# Altium schematic sheet 1_键盘矩阵.schdoc.schdoc
size 515 x 386 mm; Name: A_Customize; Symbol: A_Customize; Device: A_Customize; @Project Name: keyboard_Tassel43; REV: 1.0; Date: 2022-05-21; Sheet: 1/1; Draw By: Sanksu; Company: Your Company; Convert to PCB: yes; Add into BOM: yes
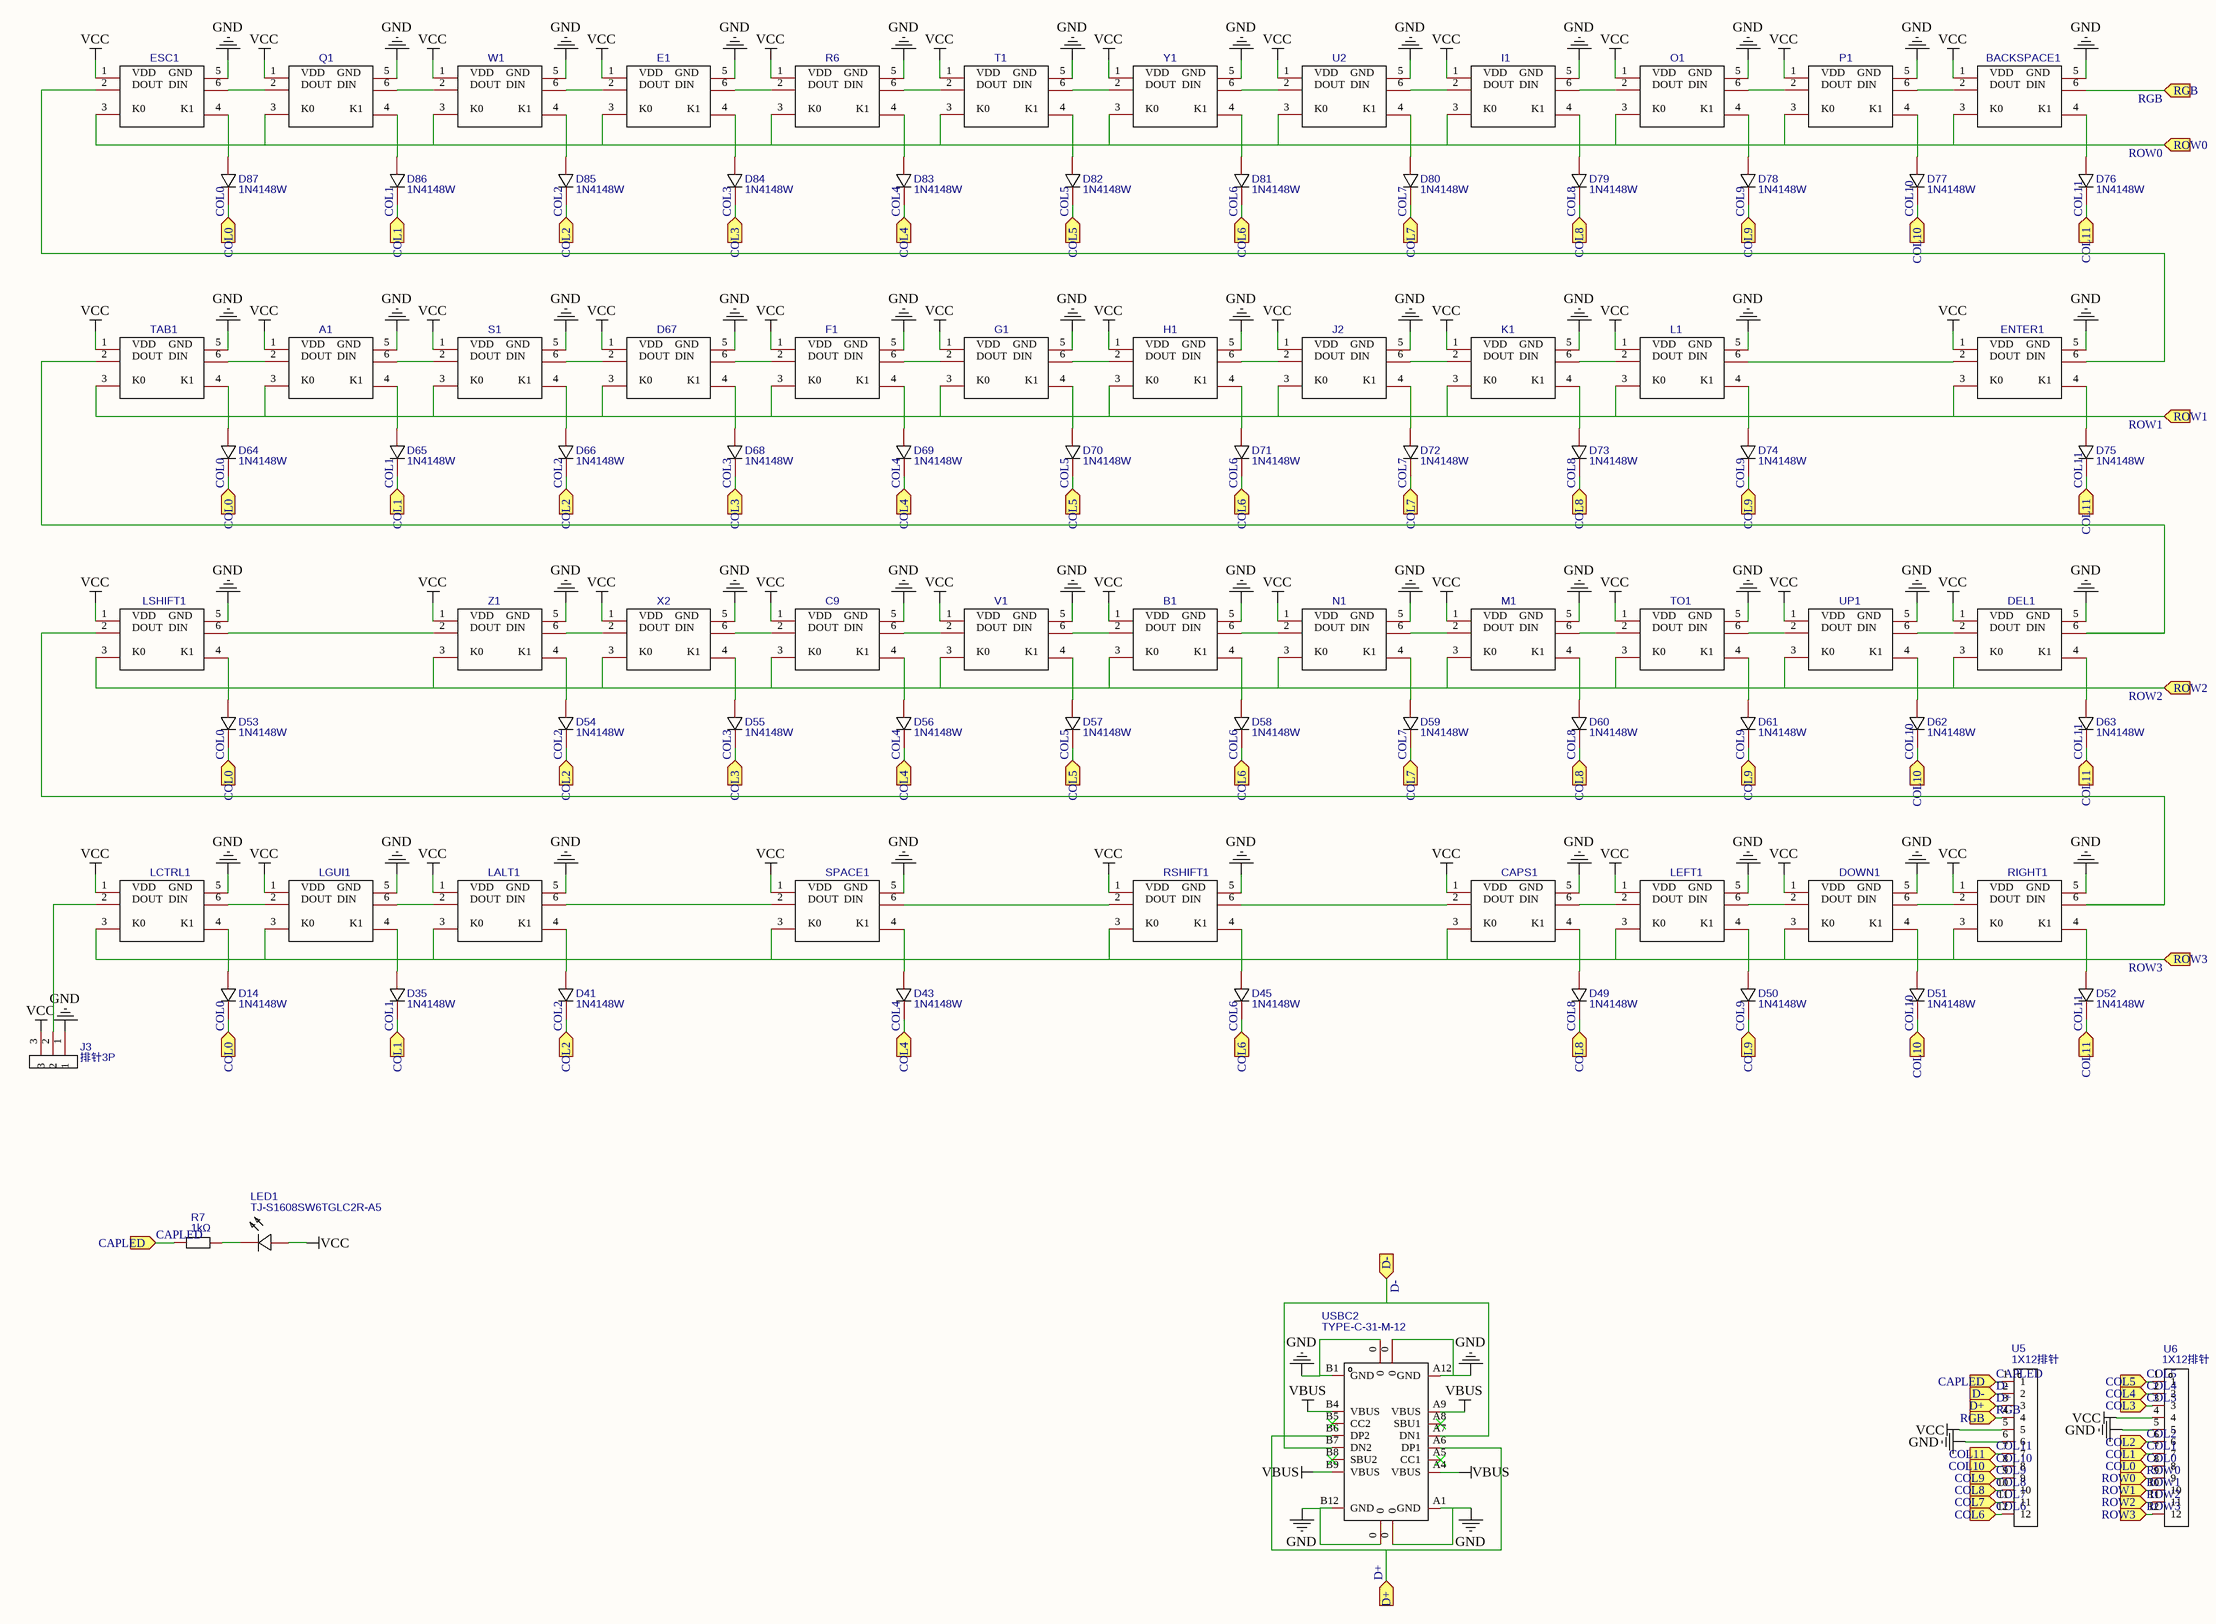
[diagram p0: 1_键盘矩阵.schdoc.schdoc]

## Parts
A1  凯华轴座+3528反贴灯  [凯华轴座+3528反贴灯]  (value not drawn)
B1  凯华轴座+3528反贴灯  [凯华轴座+3528反贴灯]  (value not drawn)
BACKSPACE1  凯华轴座+3528反贴灯  [凯华轴座+3528反贴灯]  (value not drawn)
C9  凯华轴座+3528反贴灯  [凯华轴座+3528反贴灯]  (value not drawn)
CAPS1  凯华轴座+3528反贴灯  [凯华轴座+3528反贴灯]  (value not drawn)
D14  1N4148W  [SOD-123_L2.8-W1.8-LS3.7-RD]
D35  1N4148W  [SOD-123_L2.8-W1.8-LS3.7-RD]
D41  1N4148W  [SOD-123_L2.8-W1.8-LS3.7-RD]
D43  1N4148W  [SOD-123_L2.8-W1.8-LS3.7-RD]
D45  1N4148W  [SOD-123_L2.8-W1.8-LS3.7-RD]
D49  1N4148W  [SOD-123_L2.8-W1.8-LS3.7-RD]
D50  1N4148W  [SOD-123_L2.8-W1.8-LS3.7-RD]
D51  1N4148W  [SOD-123_L2.8-W1.8-LS3.7-RD]
D52  1N4148W  [SOD-123_L2.8-W1.8-LS3.7-RD]
D53  1N4148W  [SOD-123_L2.8-W1.8-LS3.7-RD]
D54  1N4148W  [SOD-123_L2.8-W1.8-LS3.7-RD]
D55  1N4148W  [SOD-123_L2.8-W1.8-LS3.7-RD]
D56  1N4148W  [SOD-123_L2.8-W1.8-LS3.7-RD]
D57  1N4148W  [SOD-123_L2.8-W1.8-LS3.7-RD]
D58  1N4148W  [SOD-123_L2.8-W1.8-LS3.7-RD]
D59  1N4148W  [SOD-123_L2.8-W1.8-LS3.7-RD]
D60  1N4148W  [SOD-123_L2.8-W1.8-LS3.7-RD]
D61  1N4148W  [SOD-123_L2.8-W1.8-LS3.7-RD]
D62  1N4148W  [SOD-123_L2.8-W1.8-LS3.7-RD]
D63  1N4148W  [SOD-123_L2.8-W1.8-LS3.7-RD]
D64  1N4148W  [SOD-123_L2.8-W1.8-LS3.7-RD]
D65  1N4148W  [SOD-123_L2.8-W1.8-LS3.7-RD]
D66  1N4148W  [SOD-123_L2.8-W1.8-LS3.7-RD]
D67  凯华轴座+3528反贴灯  [凯华轴座+3528反贴灯]  (value not drawn)
D68  1N4148W  [SOD-123_L2.8-W1.8-LS3.7-RD]
D69  1N4148W  [SOD-123_L2.8-W1.8-LS3.7-RD]
D70  1N4148W  [SOD-123_L2.8-W1.8-LS3.7-RD]
D71  1N4148W  [SOD-123_L2.8-W1.8-LS3.7-RD]
D72  1N4148W  [SOD-123_L2.8-W1.8-LS3.7-RD]
D73  1N4148W  [SOD-123_L2.8-W1.8-LS3.7-RD]
D74  1N4148W  [SOD-123_L2.8-W1.8-LS3.7-RD]
D75  1N4148W  [SOD-123_L2.8-W1.8-LS3.7-RD]
D76  1N4148W  [SOD-123_L2.8-W1.8-LS3.7-RD]
D77  1N4148W  [SOD-123_L2.8-W1.8-LS3.7-RD]
D78  1N4148W  [SOD-123_L2.8-W1.8-LS3.7-RD]
D79  1N4148W  [SOD-123_L2.8-W1.8-LS3.7-RD]
D80  1N4148W  [SOD-123_L2.8-W1.8-LS3.7-RD]
D81  1N4148W  [SOD-123_L2.8-W1.8-LS3.7-RD]
D82  1N4148W  [SOD-123_L2.8-W1.8-LS3.7-RD]
D83  1N4148W  [SOD-123_L2.8-W1.8-LS3.7-RD]
D84  1N4148W  [SOD-123_L2.8-W1.8-LS3.7-RD]
D85  1N4148W  [SOD-123_L2.8-W1.8-LS3.7-RD]
D86  1N4148W  [SOD-123_L2.8-W1.8-LS3.7-RD]
D87  1N4148W  [SOD-123_L2.8-W1.8-LS3.7-RD]
DEL1  凯华轴座+3528反贴灯  [凯华轴座+3528反贴灯]  (value not drawn)
DOWN1  凯华轴座+3528反贴灯  [凯华轴座+3528反贴灯]  (value not drawn)
E1  凯华轴座+3528反贴灯  [凯华轴座+3528反贴灯]  (value not drawn)
ENTER1  凯华轴座+3528反贴灯  [凯华轴座+3528反贴灯]  (value not drawn)
ESC1  凯华轴座+3528反贴灯  [凯华轴座+3528反贴灯]  (value not drawn)
F1  凯华轴座+3528反贴灯  [凯华轴座+3528反贴灯]  (value not drawn)
G1  凯华轴座+3528反贴灯  [凯华轴座+3528反贴灯]  (value not drawn)
H1  凯华轴座+3528反贴灯  [凯华轴座+3528反贴灯]  (value not drawn)
I1  凯华轴座+3528反贴灯  [凯华轴座+3528反贴灯]  (value not drawn)
J2  凯华轴座+3528反贴灯  [凯华轴座+3528反贴灯]  (value not drawn)
J3  排针3P  [排针3P]
K1  凯华轴座+3528反贴灯  [凯华轴座+3528反贴灯]  (value not drawn)
L1  凯华轴座+3528反贴灯  [凯华轴座+3528反贴灯]  (value not drawn)
LALT1  凯华轴座+3528反贴灯  [凯华轴座+3528反贴灯]  (value not drawn)
LCTRL1  凯华轴座+3528反贴灯  [凯华轴座+3528反贴灯]  (value not drawn)
LED1  TJ-S1608SW6TGLC2R-A5  [LED0603-R-RD_RED]
LEFT1  凯华轴座+3528反贴灯  [凯华轴座+3528反贴灯]  (value not drawn)
LGUI1  凯华轴座+3528反贴灯  [凯华轴座+3528反贴灯]  (value not drawn)
LSHIFT1  凯华轴座+3528反贴灯  [凯华轴座+3528反贴灯]  (value not drawn)
M1  凯华轴座+3528反贴灯  [凯华轴座+3528反贴灯]  (value not drawn)
N1  凯华轴座+3528反贴灯  [凯华轴座+3528反贴灯]  (value not drawn)
O1  凯华轴座+3528反贴灯  [凯华轴座+3528反贴灯]  (value not drawn)
P1  凯华轴座+3528反贴灯  [凯华轴座+3528反贴灯]  (value not drawn)
Q1  凯华轴座+3528反贴灯  [凯华轴座+3528反贴灯]  (value not drawn)
R6  凯华轴座+3528反贴灯  [凯华轴座+3528反贴灯]  (value not drawn)
R7  1kΩ  [R0603]
RIGHT1  凯华轴座+3528反贴灯  [凯华轴座+3528反贴灯]  (value not drawn)
RSHIFT1  凯华轴座+3528反贴灯  [凯华轴座+3528反贴灯]  (value not drawn)
S1  凯华轴座+3528反贴灯  [凯华轴座+3528反贴灯]  (value not drawn)
SPACE1  凯华轴座+3528反贴灯  [凯华轴座+3528反贴灯]  (value not drawn)
T1  凯华轴座+3528反贴灯  [凯华轴座+3528反贴灯]  (value not drawn)
TAB1  凯华轴座+3528反贴灯  [凯华轴座+3528反贴灯]  (value not drawn)
TO1  凯华轴座+3528反贴灯  [凯华轴座+3528反贴灯]  (value not drawn)
U2  凯华轴座+3528反贴灯  [凯华轴座+3528反贴灯]  (value not drawn)
U5  1X12排针  [1X12排针]
U6  1X12排针  [1X12排针]
UP1  凯华轴座+3528反贴灯  [凯华轴座+3528反贴灯]  (value not drawn)
USBC2  TYPE-C-31-M-12  [USB-C_SMD-TYPE-C-31-M-12]
V1  凯华轴座+3528反贴灯  [凯华轴座+3528反贴灯]  (value not drawn)
W1  凯华轴座+3528反贴灯  [凯华轴座+3528反贴灯]  (value not drawn)
X2  凯华轴座+3528反贴灯  [凯华轴座+3528反贴灯]  (value not drawn)
Y1  凯华轴座+3528反贴灯  [凯华轴座+3528反贴灯]  (value not drawn)
Z1  凯华轴座+3528反贴灯  [凯华轴座+3528反贴灯]  (value not drawn)

## Ports
CAPLED (in), COL0 (in), COL1 (in), COL2 (in), COL3 (in), COL4 (in), COL5 (in), COL6 (in), COL7 (in), COL8 (in), COL9 (in), COL10 (in), COL11 (in), D+ (in), D- (in), RGB (in), ROW0 (in), ROW1 (in), ROW2 (in), ROW3 (in)

## Nets
GND: A1.5 B1.5 BACKSPACE1.5 C9.5 CAPS1.5 D67.5 DEL1.5 DOWN1.5 E1.5 ENTER1.5 ESC1.5 F1.5 G1.5 H1.5 I1.5 J2.5 J3.1 K1.5 L1.5 LALT1.5 LCTRL1.5 LEFT1.5 LGUI1.5 LSHIFT1.5 M1.5 N1.5 O1.5 P1.5 Q1.5 R6.5 RIGHT1.5 RSHIFT1.5 S1.5 SPACE1.5 T1.5 TAB1.5 TO1.5 U2.5 U5.6 U6.5 UP1.5 USBC2.0 USBC2.A1(GND) USBC2.A12(GND) USBC2.B1(GND) USBC2.B12(GND) V1.5 W1.5 X2.5 Y1.5 Z1.5
VBUS: USBC2.A4(VBUS) USBC2.A9(VBUS) USBC2.B4(VBUS) USBC2.B9(VBUS)
VCC: A1.1 B1.1 BACKSPACE1.1 C9.1 CAPS1.1 D67.1 DEL1.1 DOWN1.1 E1.1 ENTER1.1 ESC1.1 F1.1 G1.1 H1.1 I1.1 J2.1 J3.3 K1.1 L1.1 LALT1.1 LCTRL1.1 LED1.1(A) LEFT1.1 LGUI1.1 LSHIFT1.1 M1.1 N1.1 O1.1 P1.1 Q1.1 R6.1 RIGHT1.1 RSHIFT1.1 S1.1 SPACE1.1 T1.1 TAB1.1 TO1.1 U2.1 U5.5 U6.4 UP1.1 V1.1 W1.1 X2.1 Y1.1 Z1.1
CAPLED: R7.1 U5.1 ; port CAPLED
COL0: D14.1(K) D53.1(K) D64.1(K) D87.1(K) U6.8 ; port COL0
COL1: D35.1(K) D65.1(K) D86.1(K) U6.7 ; port COL1
COL2: D41.1(K) D54.1(K) D66.1(K) D85.1(K) U6.6 ; port COL2
COL3: D55.1(K) D68.1(K) D84.1(K) U6.3 ; port COL3
COL4: D43.1(K) D56.1(K) D69.1(K) D83.1(K) U6.2 ; port COL4
COL5: D57.1(K) D70.1(K) D82.1(K) U6.1 ; port COL5
COL6: D45.1(K) D58.1(K) D71.1(K) D81.1(K) U5.12 ; port COL6
COL7: D59.1(K) D72.1(K) D80.1(K) U5.11 ; port COL7
COL8: D49.1(K) D60.1(K) D73.1(K) D79.1(K) U5.10 ; port COL8
COL9: D50.1(K) D61.1(K) D74.1(K) D78.1(K) U5.9 ; port COL9
COL10: D51.1(K) D62.1(K) D77.1(K) U5.8 ; port COL10
COL11: D52.1(K) D63.1(K) D75.1(K) D76.1(K) U5.7 ; port COL11
D+: U5.3 USBC2.A6(DP1) USBC2.B6(DP2) ; port D+
D-: U5.2 USBC2.A7(DN1) USBC2.B7(DN2) ; port D-
RGB: BACKSPACE1.6 U5.4 ; port RGB
ROW0: BACKSPACE1.3 E1.3 ESC1.3 I1.3 O1.3 P1.3 Q1.3 R6.3 T1.3 U2.3 U6.9 W1.3 Y1.3 ; port ROW0
ROW1: A1.3 D67.3 ENTER1.3 F1.3 G1.3 H1.3 J2.3 K1.3 L1.3 S1.3 TAB1.3 U6.10 ; port ROW1
ROW2: B1.3 C9.3 DEL1.3 LSHIFT1.3 M1.3 N1.3 TO1.3 U6.11 UP1.3 V1.3 X2.3 Z1.3 ; port ROW2
ROW3: CAPS1.3 DOWN1.3 LALT1.3 LCTRL1.3 LEFT1.3 LGUI1.3 RIGHT1.3 RSHIFT1.3 SPACE1.3 U6.12 ; port ROW3
NetA1_2: A1.2 TAB1.6
NetA1_4: A1.4 D65.2(A)
NetA1_6: A1.6 S1.2
NetB1_2: B1.2 V1.6
NetB1_4: B1.4 D58.2(A)
NetB1_6: B1.6 N1.2
NetBACKSPACE1_2: BACKSPACE1.2 P1.6
NetBACKSPACE1_4: BACKSPACE1.4 D76.2(A)
NetC9_2: C9.2 X2.6
NetC9_4: C9.4 D56.2(A)
NetC9_6: C9.6 V1.2
NetCAPS1_2: CAPS1.2 RSHIFT1.6
NetCAPS1_4: CAPS1.4 D49.2(A)
NetCAPS1_6: CAPS1.6 LEFT1.2
NetD14_2: D14.2(A) LCTRL1.4
NetD35_2: D35.2(A) LGUI1.4
NetD41_2: D41.2(A) LALT1.4
NetD43_2: D43.2(A) SPACE1.4
NetD45_2: D45.2(A) RSHIFT1.4
NetD50_2: D50.2(A) LEFT1.4
NetD51_2: D51.2(A) DOWN1.4
NetD52_2: D52.2(A) RIGHT1.4
NetD53_2: D53.2(A) LSHIFT1.4
NetD54_2: D54.2(A) Z1.4
NetD55_2: D55.2(A) X2.4
NetD57_2: D57.2(A) V1.4
NetD59_2: D59.2(A) N1.4
NetD60_2: D60.2(A) M1.4
NetD61_2: D61.2(A) TO1.4
NetD62_2: D62.2(A) UP1.4
NetD63_2: D63.2(A) DEL1.4
NetD64_2: D64.2(A) TAB1.4
NetD66_2: D66.2(A) S1.4
NetD67_2: D67.2 S1.6
NetD67_4: D67.4 D68.2(A)
NetD67_6: D67.6 F1.2
NetD69_2: D69.2(A) F1.4
NetD70_2: D70.2(A) G1.4
NetD71_2: D71.2(A) H1.4
NetD72_2: D72.2(A) J2.4
NetD73_2: D73.2(A) K1.4
NetD74_2: D74.2(A) L1.4
NetD75_2: D75.2(A) ENTER1.4
NetD77_2: D77.2(A) P1.4
NetD78_2: D78.2(A) O1.4
NetD79_2: D79.2(A) I1.4
NetD80_2: D80.2(A) U2.4
NetD81_2: D81.2(A) Y1.4
NetD82_2: D82.2(A) T1.4
NetD83_2: D83.2(A) R6.4
NetD84_2: D84.2(A) E1.4
NetD85_2: D85.2(A) W1.4
NetD86_2: D86.2(A) Q1.4
NetD87_2: D87.2(A) ESC1.4
NetDEL1_2: DEL1.2 UP1.6
NetDEL1_6: DEL1.6 TAB1.2
NetDOWN1_2: DOWN1.2 LEFT1.6
NetDOWN1_6: DOWN1.6 RIGHT1.2
NetE1_2: E1.2 W1.6
NetE1_6: E1.6 R6.2
NetENTER1_2: ENTER1.2 L1.6
NetENTER1_6: ENTER1.6 ESC1.2
NetESC1_6: ESC1.6 Q1.2
NetF1_6: F1.6 G1.2
NetG1_6: G1.6 H1.2
NetH1_6: H1.6 J2.2
NetI1_2: I1.2 U2.6
NetI1_6: I1.6 O1.2
NetJ2_6: J2.6 K1.2
NetJ3_2: J3.2 LCTRL1.2
NetK1_6: K1.6 L1.2
NetLALT1_2: LALT1.2 LGUI1.6
NetLALT1_6: LALT1.6 SPACE1.2
NetLCTRL1_6: LCTRL1.6 LGUI1.2
NetLED1_2: LED1.2(K) R7.2
NetLSHIFT1_2: LSHIFT1.2 RIGHT1.6
NetLSHIFT1_6: LSHIFT1.6 Z1.2
NetM1_2: M1.2 N1.6
NetM1_6: M1.6 TO1.2
NetO1_6: O1.6 P1.2
NetQ1_6: Q1.6 W1.2
NetR6_6: R6.6 T1.2
NetRSHIFT1_2: RSHIFT1.2 SPACE1.6
NetT1_6: T1.6 Y1.2
NetTO1_6: TO1.6 UP1.2
NetU2_2: U2.2 Y1.6
NetX2_2: X2.2 Z1.6

Not connected (* = marked no-connect by the designer): USBC2 A5(CC1)* A8(SBU1)* B5(CC2)* B8(SBU2)*

## Notes on the sheet
- 1
- 2
- 3
- 4
- 5
- 6
- 7
- 8
- 9
- 10
- A
- B
- C
- D
- E
- F
- G
- TITLE:
- keyboard_Tassel43
- REV:
- 1.0
- Date:
- Company:
- 2022-05-21
- Drawn By:
- Sanksu
- Sheet:
- 1/1
- (in symbol 凯华轴座+3528反贴灯) VDD; GND; DOUT; DIN; K0; K1

## Library data of the parts
A1 B1 BACKSPACE1 C9 CAPS1 D67 DEL1 DOWN1 E1 ENTER1 ESC1 F1 G1 H1 I1 J2 K1 L1 LALT1 LCTRL1 LEFT1 LGUI1 LSHIFT1 M1 N1 O1 P1 Q1 R6 RIGHT1 RSHIFT1 S1 SPACE1 T1 TAB1 TO1 U2 UP1 V1 W1 X2 Y1 Z1 = 凯华轴座+3528反贴灯: Convert to PCB: yes; Add into BOM: no; Name: 凯华轴座+3528反贴灯; Symbol: 凯华轴座+3528反贴灯; Device: 凯华轴座+3528反贴灯; Origin Footprint: 凯华轴座+3528反贴灯
D14 D35 D41 D43 D45 D49-D66 D68-D87 = 1N4148W: Manufacturer: HT; Convert to PCB: yes; Name: 1N4148W; Symbol: 1N4148W; Device: 1N4148W; Supplier: LCSC; Manufacturer Part: 1N4148W; Supplier Part: C179717; JLCPCB Part Class: Extended Part; Add into BOM: yes; Origin Footprint: SOD-123_L2.8-W1.8-LS3.7-RD
J3 = 排针3P: Convert to PCB: yes; Name: 排针3P; Symbol: 排针3P; Device: 排针3P; Add into BOM: yes; Origin Footprint: 排针3P
LED1 = TJ-S1608SW6TGLC2R-A5: Manufacturer: TOGIALED; Convert to PCB: yes; Name: TJ-S1608SW6TGLC2R-A5; Symbol: TJ-S1608SW6TGLC2R-A5; Device: TJ-S1608SW6TGLC2R-A5; Supplier: LCSC; Supplier Part: C192315; Manufacturer Part: TJ-S1608SW6TGLC2R-A5; JLCPCB Part Class: Extended Part; Add into BOM: yes; Origin Footprint: LED0603-R-RD_RED
R7 = ETCR0603F1K00K9: Manufacturer: ResistorToday; Resistance: 1K; Convert to PCB: yes; Name: 1kΩ; Symbol: 1kΩ; Device: ETCR0603F1K00K9; Supplier: LCSC; Supplier Part: C365394; Manufacturer Part: ETCR0603F1K00K9; JLCPCB Part Class: Extended Part; Add into BOM: yes; Origin Footprint: R0603
U5 U6 = 1X12排针: Convert to PCB: yes; Name: 1X12排针; Symbol: 1X12排针; Device: 1X12排针; Add into BOM: yes; Origin Footprint: 1X12排针
USBC2 = TYPE-C-31-M-12: Manufacturer: RectangularConnectors-Contacts; Convert to PCB: yes; Name: TYPE-C-31-M-12; Symbol: TYPE-C-31-M-12; Device: TYPE-C-31-M-12; Supplier: LCSC; Supplier Part: C165948; Manufacturer Part: TYPE-C-31-M-12; JLCPCB Part Class: ExtendedPart; Add into BOM: yes; Origin Footprint: USB-C_SMD-TYPE-C-31-M-12